# EAGLE design Atmel-328p (EAGLE 7.4.0)
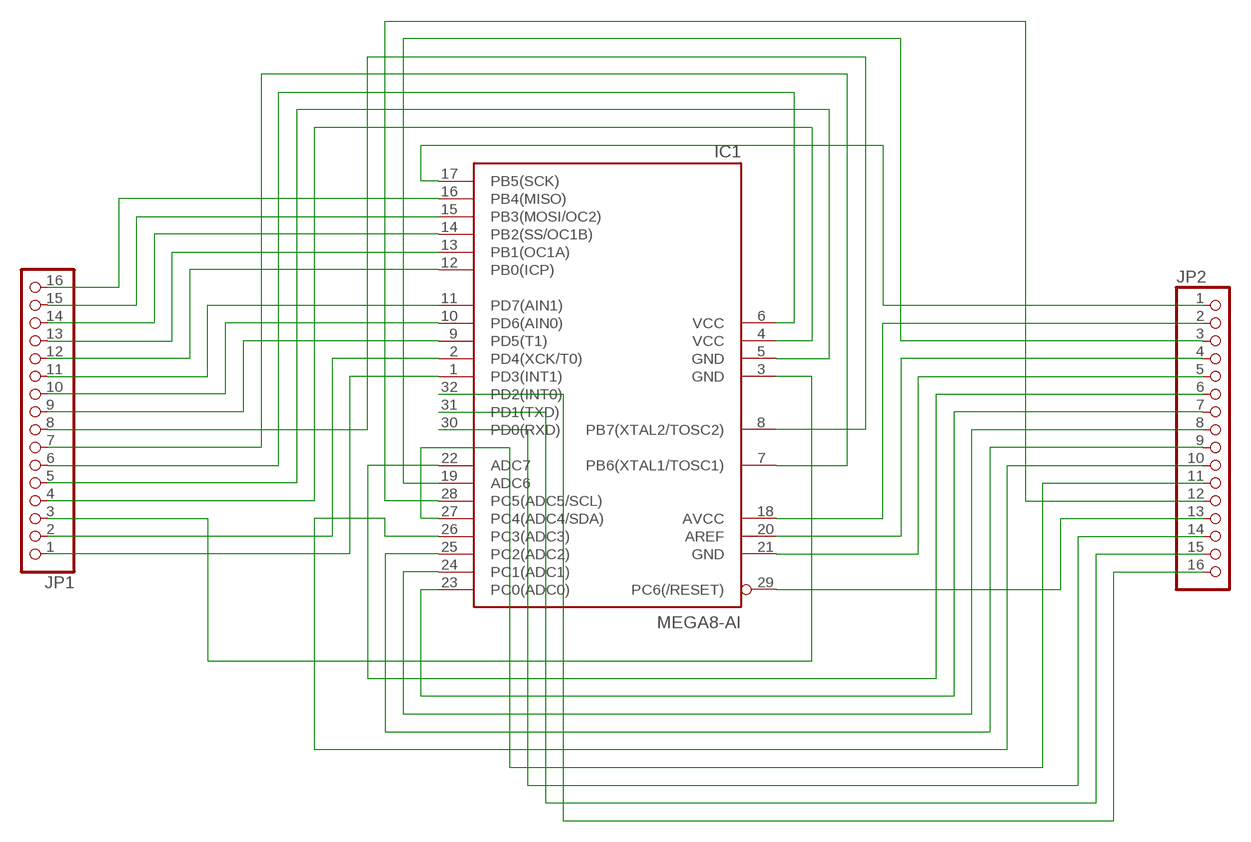
[diagram p0: schematic, sheet 1]

## Parts
IC1  MEGA8-AI  [TQFP32-08]
JP1  PINHD-1X16  [1X16]
JP2  PINHD-1X16  [1X16]

## Nets
N$1: IC1.1(PD3(INT1)) JP1.1
N$2: IC1.2(PD4(XCK/T0)) JP1.2
N$3: IC1.3(GND) JP1.3
N$4: IC1.4(VCC) JP1.4
N$5: IC1.5(GND) JP1.5
N$6: IC1.6(VCC) JP1.6
N$7: IC1.7(PB6(XTAL1/TOSC1)) JP1.7
N$8: IC1.8(PB7(XTAL2/TOSC2)) JP1.8
N$9: IC1.9(PD5(T1)) JP1.9
N$10: IC1.10(PD6(AIN0)) JP1.10
N$11: IC1.11(PD7(AIN1)) JP1.11
N$12: IC1.12(PB0(ICP)) JP1.12
N$13: IC1.13(PB1(OC1A)) JP1.13
N$14: IC1.14(PB2(SS/OC1B)) JP1.14
N$15: IC1.15(PB3(MOSI/OC2)) JP1.15
N$16: IC1.16(PB4(MISO)) JP1.16
N$17: IC1.17(PB5(SCK)) JP2.1
N$18: IC1.18(AVCC) JP2.2
N$19: IC1.20(AREF) JP2.4
N$20: IC1.21(GND) JP2.5
N$21: IC1.22(ADC7) JP2.6
N$22: IC1.19(ADC6) JP2.3
N$23: IC1.23(PC0(ADC0)) JP2.7
N$24: IC1.24(PC1(ADC1)) JP2.8
N$25: IC1.25(PC2(ADC2)) JP2.9
N$27: IC1.26(PC3(ADC3)) JP2.10
N$28: IC1.28(PC5(ADC5/SCL)) JP2.12
N$29: IC1.27(PC4(ADC4/SDA)) JP2.11
N$30: IC1.29(PC6(/RESET)) JP2.13
N$31: IC1.30(PD0(RXD)) JP2.14
N$32: IC1.31(PD1(TXD)) JP2.15
N$33: IC1.32(PD2(INT0)) JP2.16

## Library data of the parts
IC1 = atmel:MEGA8: MICROCONTROLLER 8 Kbytes FLASH, 1 kbytes SRAM, 512 bytes EEPROM, USART, 6-channel 10 bit ADC, 2-channel 8 bit ADC Pin compatible with Atmega48, ATMega88, ATMega168 Source: avr.lbr; MPN: ATMEGA8-16AU; OC_FARNELL: 9171371; OC_NEWARK: 73M8863
JP1 JP2 = pinhead:PINHD-1X16: PIN HEADER

## Board
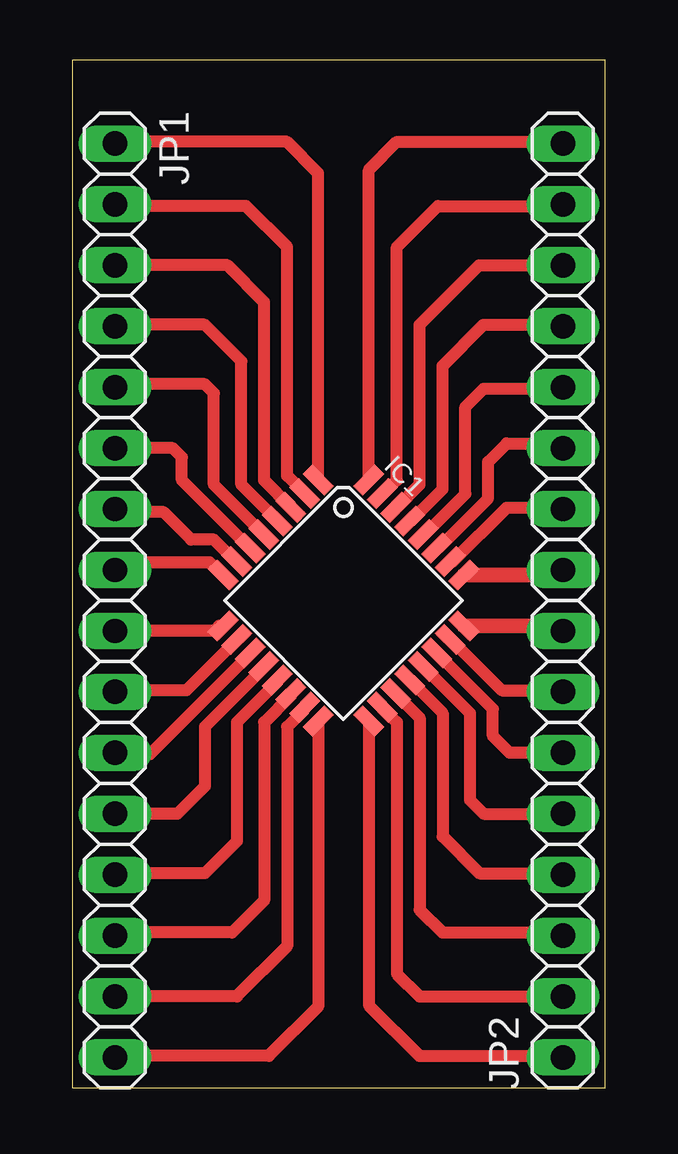
[diagram p1: board, top side]

Size 22.2 x 42.85 mm. Coordinates in mm from the lower left corner, seen from the top.
Outline: 0,0 22.2,0 22.2,42.85 0,42.85 0,0
Copper layers (1*16): Top 0.035mm / dielectric 1.5mm / Bottom 0.035mm
Design rules "default": minimum track width 10mil, minimum drill 24mil, track to track 8mil, track to pad 8mil, pad to pad 8mil, via to via 8mil, smd to smd 8mil, copper to edge 40mil, drill to drill 8mil, minimum pad ring 10mil, minimum via ring 8mil, stop-mask expansion 4mil, vias tented up to drill 0mil, thermal gap 10mil

### Footprints (pad centres in the part's own frame; a part is rotated, then mirrored left to right if it is on the bottom)
TQFP32-08 = smd 1.27 x 0.559: 1 -4.293,2.8; 2 -4.293,2; 3 -4.293,1.2; 4 -4.293,0.4; 5 -4.293,-0.4; 6 -4.293,-1.2; 7 -4.293,-2; 8 -4.293,-2.8; 17 4.293,-2.8; 18 4.293,-2; 19 4.293,-1.2; 20 4.293,-0.4; 21 4.293,0.4; 22 4.293,1.2; 23 4.293,2; 24 4.293,2.8 | smd 0.559 x 1.27: 9 -2.8,-4.293; 10 -2,-4.293; 11 -1.2,-4.293; 12 -0.4,-4.293; 13 0.4,-4.293; 14 1.2,-4.293; 15 2,-4.293; 16 2.8,-4.293; 25 2.8,4.293; 26 2,4.293; 27 1.2,4.293; 28 0.4,4.293; 29 -0.4,4.293; 30 -1.2,4.293; 31 -2,4.293; 32 -2.8,4.293
1X16 = drill 1.016 long: 1 -19.05,0; 2 -16.51,0; 3 -13.97,0; 4 -11.43,0; 5 -8.89,0; 6 -6.35,0; 7 -3.81,0; 8 -1.27,0; 9 1.27,0; 10 3.81,0; 11 6.35,0; 12 8.89,0; 13 11.43,0; 14 13.97,0; 15 16.51,0; 16 19.05,0

### Placement (x,y rotation side)
IC1  11.3,20.32 315 top
JP1  1.78,20.32 270 top
JP2  20.45,20.32 90 top

### Tracks (layer width: path | path; a pad name or v marks a point on that pad's centre or on a via)
N$1
  Top 0.508: IC1.1 10.25,38.14 8.95,39.43 1.84,39.43 JP1.1
N$2
  Top 0.508: IC1.2 9.68,24.8 8.95,25.53 8.95,35.05 7.24,36.77 1.84,36.77 JP1.2
N$3
  Top 0.508: IC1.3 9.12,24.22 8,25.34 8,32.77 6.48,34.29 JP1.3
N$4
  Top 0.508: IC1.4 7.05,25.15 7.05,30.29 5.52,31.81 1.84,31.81 JP1.4
N$5
  Top 0.508: IC1.5 5.91,25.15 5.91,28.96 5.52,29.34 1.91,29.34 JP1.5
N$6
  Top 0.508: IC1.6 7.4,22.51 4.57,25.34 4.57,26.29 4.19,26.67 JP1.6
N$7
  Top 0.508: IC1.7 6.82,21.94 5.91,22.86 4.95,22.86 3.81,24 1.91,24 JP1.7
N$8
  Top 0.508: IC1.8 6.25,21.38 5.71,21.91 2.1,21.91 JP1.8
N$9
  Top 0.508: IC1.9 6.12,19.27 5.91,19.05 JP1.9
N$10
  Top 0.508: IC1.10 6.85,18.66 4.76,16.57 1.84,16.57 JP1.10
N$11
  Top 0.508: IC1.11 7.42,18.09 3.24,13.91 1.84,13.91 JP1.11
N$12
  Top 0.508: IC1.12 7.99,17.51 5.52,15.05 5.52,12.57 4.38,11.43 JP1.12
N$13
  Top 0.508: IC1.13 8.55,16.93 6.86,15.24 6.86,10.29 5.52,8.95 1.84,8.95 JP1.13
N$14
  Top 0.508: IC1.14 9.12,16.36 8,15.24 8,7.81 6.67,6.48 1.91,6.48 JP1.14
N$15
  Top 0.508: IC1.15 9.68,15.78 8.95,15.05 8.95,5.91 6.86,3.81 JP1.15
N$16
  Top 0.508: IC1.16 10.25,3.39 8.19,1.33 1.84,1.33 JP1.16
N$17
  Top 0.508: IC1.17 12.36,3.45 14.48,1.33 20.38,1.33 JP2.1
N$18
  Top 0.508: IC1.18 12.92,15.84 13.53,15.24 13.53,4.76 14.48,3.81 JP2.2
N$19
  Top 0.508: IC1.20 15.43,15.62 15.43,10.48 16.95,8.95 20.38,8.95 JP2.4
N$20
  Top 0.508: IC1.21 16.57,15.62 16.57,12 17.14,11.43 JP2.5
N$21
  Top 0.508: JP2.6 18.22,13.97 17.53,14.67 17.53,15.79 IC1.22
N$22
  Top 0.508: IC1.19 13.49,16.42 14.48,15.43 14.48,7.43 15.43,6.48 20.32,6.48 JP2.3
N$23
  Top 0.508: IC1.23 15.78,18.7 17.91,16.57 20.38,16.57 JP2.7
N$24
  Top 0.61: IC1.24 20.23,19.27 JP2.8
N$25
  Top 0.61: IC1.25 20.23,21.38 JP2.9
N$27
  Top 0.508: IC1.26 15.85,21.94 18.1,24.19 20.38,24.19 JP2.10
N$28
  Top 0.508: IC1.28 14.69,23.07 16.38,24.77 16.38,28.38 17.14,29.15 20.38,29.15 JP2.12
N$29
  Top 0.508: IC1.27 15.27,22.51 17.34,24.57 17.34,26.1 18.1,26.86 20.26,26.86 JP2.11
N$30
  Top 0.508: IC1.29 14.11,23.64 15.43,24.96 15.43,30.1 17.14,31.81 20.38,31.81 JP2.13
N$31
  Top 0.508: IC1.30 13.54,24.2 14.48,25.15 14.48,31.81 16.95,34.29 JP2.14
N$32
  Top 0.508: IC1.31 12.96,24.77 13.53,25.34 13.53,35.05 15.24,36.77 20.38,36.77 JP2.15
N$33
  Top 0.508: IC1.32 12.36,38.27 13.53,39.43 20.38,39.43 JP2.16